# Altium schematic sheet badge5.SchDoc
size Letter
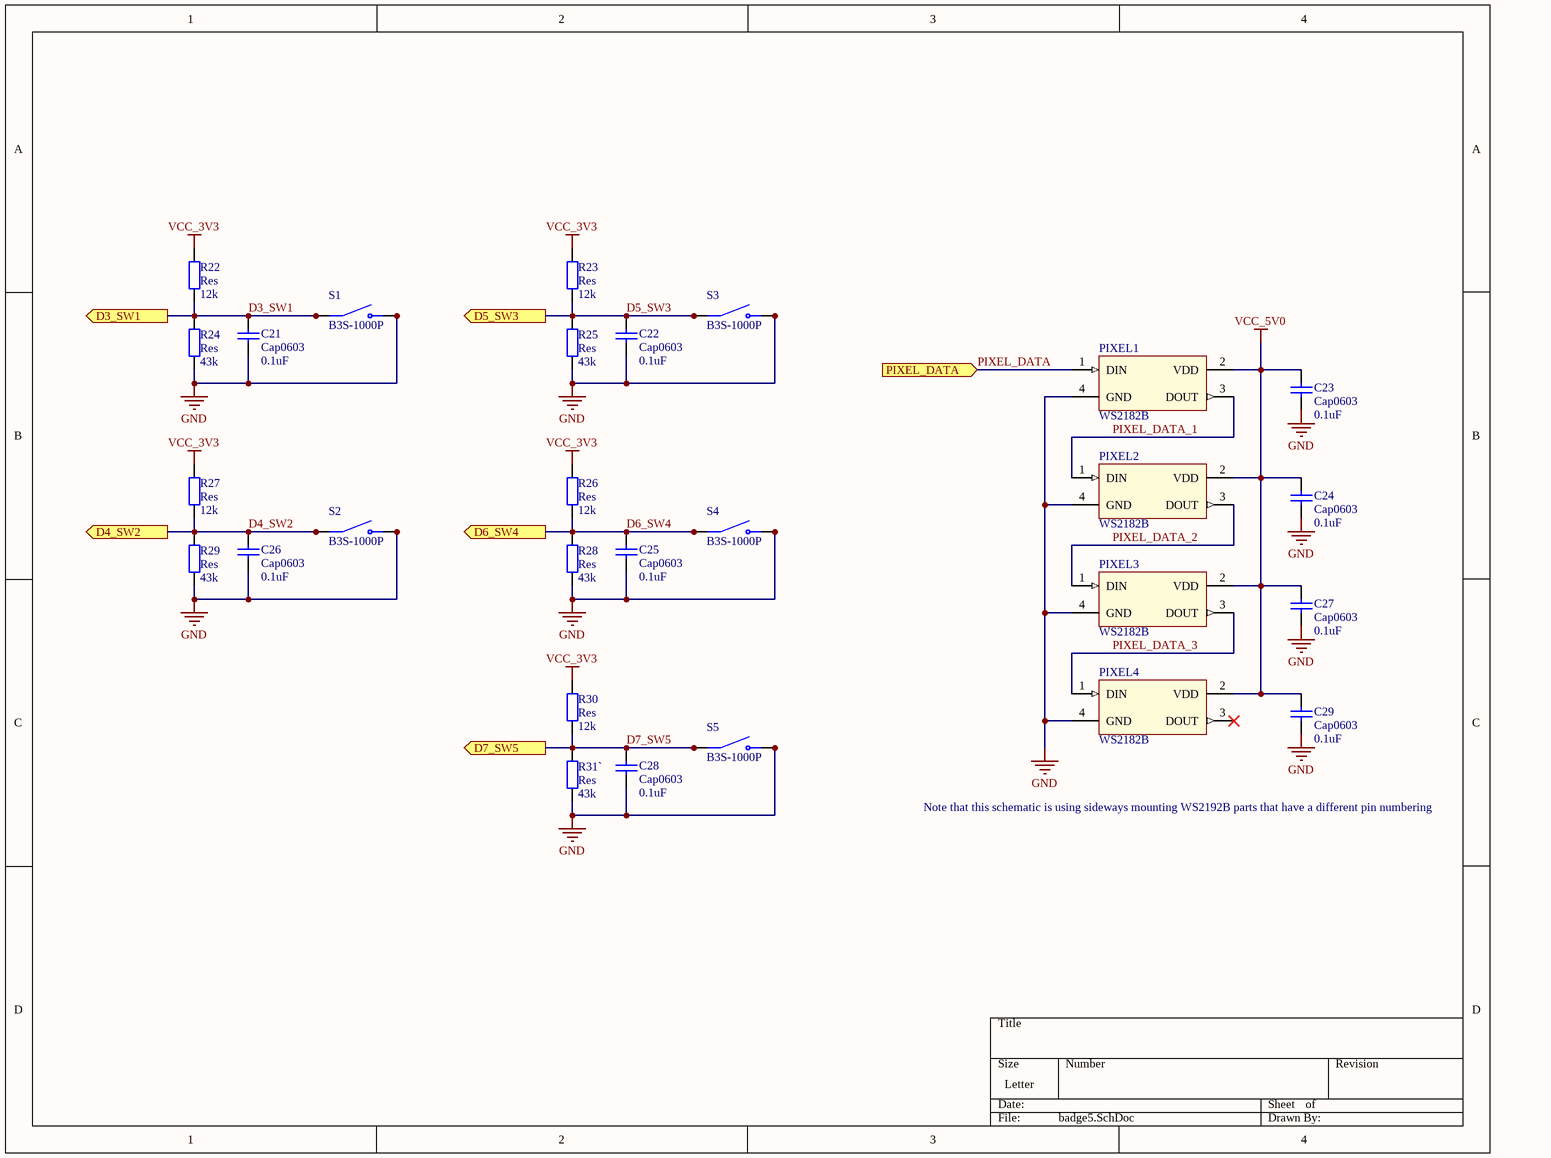
[diagram p0: badge5.SchDoc]

## Parts
C21  Cap0603  value 0.1uF  [C0603]
C22  Cap0603  value 0.1uF  [C0603]
C23  Cap0603  value 0.1uF  [C0603]
C24  Cap0603  value 0.1uF  [C0603]
C25  Cap0603  value 0.1uF  [C0603]
C26  Cap0603  value 0.1uF  [C0603]
C27  Cap0603  value 0.1uF  [C0603]
C28  Cap0603  value 0.1uF  [C0603]
C29  Cap0603  value 0.1uF  [C0603]
PIXEL1  WS2182B  [WS2812B_SIDE]
PIXEL2  WS2182B  [WS2812B_SIDE]
PIXEL3  WS2182B  [WS2812B_SIDE]
PIXEL4  WS2182B  [WS2812B_SIDE]
R22  Res  value 12k  [R0603]
R23  Res  value 12k  [R0603]
R24  Res  value 43k  [R0603]
R25  Res  value 43k  [R0603]
R26  Res  value 12k  [R0603]
R27  Res  value 12k  [R0603]
R28  Res  value 43k  [R0603]
R29  Res  value 43k  [R0603]
R30  Res  value 12k  [R0603]
R31`  Res  value 43k  [R0603]
S1  B3S-1000P  [SW_B3S-1000P]
S2  B3S-1000P  [SW_B3S-1000P]
S3  B3S-1000P  [SW_B3S-1000P]
S4  B3S-1000P  [SW_B3S-1000P]
S5  B3S-1000P  [SW_B3S-1000P]

## Ports
D3_SW1 (out), D4_SW2 (out), D5_SW3 (out), D6_SW4 (out), D7_SW5 (out), PIXEL_DATA (in)

## Nets
GND: C21.1 C22.1 C23.1 C24.1 C25.1 C26.1 C27.1 C28.1 C29.1 PIXEL1.4(GND) PIXEL2.4(GND) PIXEL3.4(GND) PIXEL4.4(GND) R24.1 R25.1 R28.1 R29.1 R31`.1 S1.3(NO) S1.4(NO) S2.3(NO) S2.4(NO) S3.3(NO) S3.4(NO) S4.3(NO) S4.4(NO) S5.3(NO) S5.4(NO)
VCC_3V3: R22.2 R23.2 R26.2 R27.2 R30.2
VCC_5V0: C23.2 C24.2 C27.2 C29.2 PIXEL1.2(VDD) PIXEL2.2(VDD) PIXEL3.2(VDD) PIXEL4.2(VDD)
D3_SW1: C21.2 R22.1 R24.2 S1.1(COM) S1.2(COM) ; port D3_SW1
D4_SW2: C26.2 R27.1 R29.2 S2.1(COM) S2.2(COM) ; port D4_SW2
D5_SW3: C22.2 R23.1 R25.2 S3.1(COM) S3.2(COM) ; port D5_SW3
D6_SW4: C25.2 R26.1 R28.2 S4.1(COM) S4.2(COM) ; port D6_SW4
D7_SW5: C28.2 R30.1 R31`.2 S5.1(COM) S5.2(COM) ; port D7_SW5
PIXEL_DATA: PIXEL1.1(DIN) ; port PIXEL_DATA
PIXEL_DATA_1: PIXEL1.3(DOUT) PIXEL2.1(DIN)
PIXEL_DATA_2: PIXEL2.3(DOUT) PIXEL3.1(DIN)
PIXEL_DATA_3: PIXEL3.3(DOUT) PIXEL4.1(DIN)

Not connected (* = marked no-connect by the designer): PIXEL4 3(DOUT)*

## Notes on the sheet
- Note that this schematic is using sideways mounting WS2192B parts that have a different pin numbering

## Library data of the parts
C21-C29 = Cap0603: Capacitor; MF: KEMET; MP: C0603C104Z3VACTU; Published: 8-Jun-2000; LatestRevisionDate: 17-Jul-2002; LatestRevisionNote: Re-released for DXP Platform.; PackageReference: 0603; Publisher: Altium Limited; PackageDescription: SMD Capacitor
PIXEL1-PIXEL4 = WS2182B: MF: DNP; MP: DNP
R22 R23 R26 R27 R30 = Res: Resistor; MP: RC0603JR-0712KL; MF: Yageo; Published: 8-Jun-2000; LatestRevisionDate: 17-Jul-2002; LatestRevisionNote: Re-released for DXP Platform.; PackageReference: AXIAL-0.4; Publisher: Altium Limited; PackageDescription: SMD Resistor
R24 R25 R28 R29 R31` = Res: Resistor; MF: Yageo; MP: RC0603JR-0743KL; Published: 8-Jun-2000; LatestRevisionDate: 17-Jul-2002; LatestRevisionNote: Re-released for DXP Platform.; PackageReference: 0603; Publisher: Altium Limited; PackageDescription: SMD Resistor
S1-S5 = B3S-1000P: Tactile Switch SPST-NO Top Actuated Surface Mount; MF: Omron Electronics; Package: SMD-4 Omron Electronics Inc-EMC Div; Value: *; Price: None; MP: B3S-1000P; Availability: Unavailable; SnapEDA_Link: https://www.snapeda.com/parts/B3S-1000P/Omron%20Electronics%20Inc-EMC%20Div/view-part/273491/?ref=snap